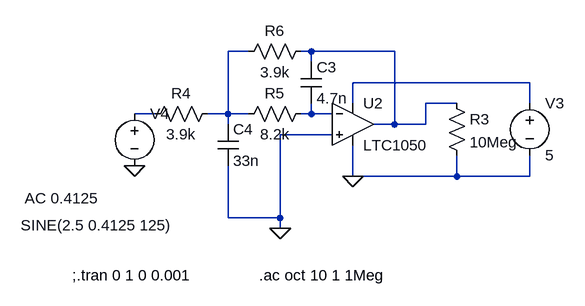
[diagram p0: schematic phototransistor-filter.asc]
phototransistor-filter.asc, the LTspice schematic file:
Version 4
SHEET 1 1444 680
WIRE -192 0 -224 0
WIRE -96 0 -112 0
WIRE 32 0 -96 0
WIRE -96 16 -96 0
WIRE 240 48 -32 48
WIRE -32 80 -32 48
WIRE 128 80 80 80
WIRE 240 80 240 48
WIRE -336 96 -368 96
WIRE -224 96 -224 0
WIRE -224 96 -256 96
WIRE -192 96 -224 96
WIRE -96 96 -96 80
WIRE -96 96 -112 96
WIRE -64 96 -96 96
WIRE -224 112 -224 96
WIRE 32 112 32 0
WIRE 32 112 0 112
WIRE 80 112 80 80
WIRE 80 112 32 112
WIRE -64 128 -144 128
WIRE -32 192 -32 144
WIRE 128 192 128 160
WIRE 128 192 -32 192
WIRE 240 192 240 160
WIRE 240 192 128 192
WIRE -224 256 -224 176
WIRE -144 256 -144 128
WIRE -144 256 -224 256
WIRE -144 272 -144 256
FLAG -144 272 0
FLAG -32 192 0
FLAG -368 176 0
SYMBOL Opamps\\LTC1050 -32 48 R0
SYMATTR InstName U2
SYMBOL voltage 240 64 R0
WINDOW 123 0 0 Left 2
WINDOW 39 0 0 Left 2
SYMATTR InstName V3
SYMATTR Value 5
SYMBOL res 112 64 R0
SYMATTR InstName R3
SYMATTR Value 10Meg
SYMBOL res -240 80 R90
WINDOW 0 0 56 VBottom 2
WINDOW 3 32 56 VTop 2
SYMATTR InstName R4
SYMATTR Value 3.9k
SYMBOL res -96 80 R90
WINDOW 0 0 56 VBottom 2
WINDOW 3 32 56 VTop 2
SYMATTR InstName R5
SYMATTR Value 8.2k
SYMBOL res -96 -16 R90
WINDOW 0 0 56 VBottom 2
WINDOW 3 32 56 VTop 2
SYMATTR InstName R6
SYMATTR Value 3.9k
SYMBOL cap -112 16 R0
SYMATTR InstName C3
SYMATTR Value 4.7n
SYMBOL cap -240 112 R0
SYMATTR InstName C4
SYMATTR Value 33n
SYMBOL voltage -368 80 R0
WINDOW 3 -175 187 Left 2
WINDOW 123 -169 146 Left 2
WINDOW 39 0 0 Left 2
SYMATTR Value SINE(2.5 0.4125 125)
SYMATTR Value2 AC 0.4125
SYMATTR InstName V4
TEXT -176 344 Left 2 !.ac oct 10 1 1Meg
TEXT -464 344 Left 2 !;.tran 0 1 0 0.001

The netlist it stands for:
* phototransistor-filter.asc
XU2 0 N005 N003 0 N002 LTC1050  ; pins In+ In- V+ V- OUT
V3 N003 0 5
R3 N002 0 10Meg
R4 N001 N004 3.9k
R5 N005 N001 8.2k
R6 N002 N001 3.9k
C3 N002 N005 4.7n
C4 N001 0 33n
V4 N004 0 SINE(2.5 0.4125 125) AC 0.4125
.ac oct 10 1 1Meg
;.tran 0 1 0 0.001
.lib LTC.lib
.backanno
.end